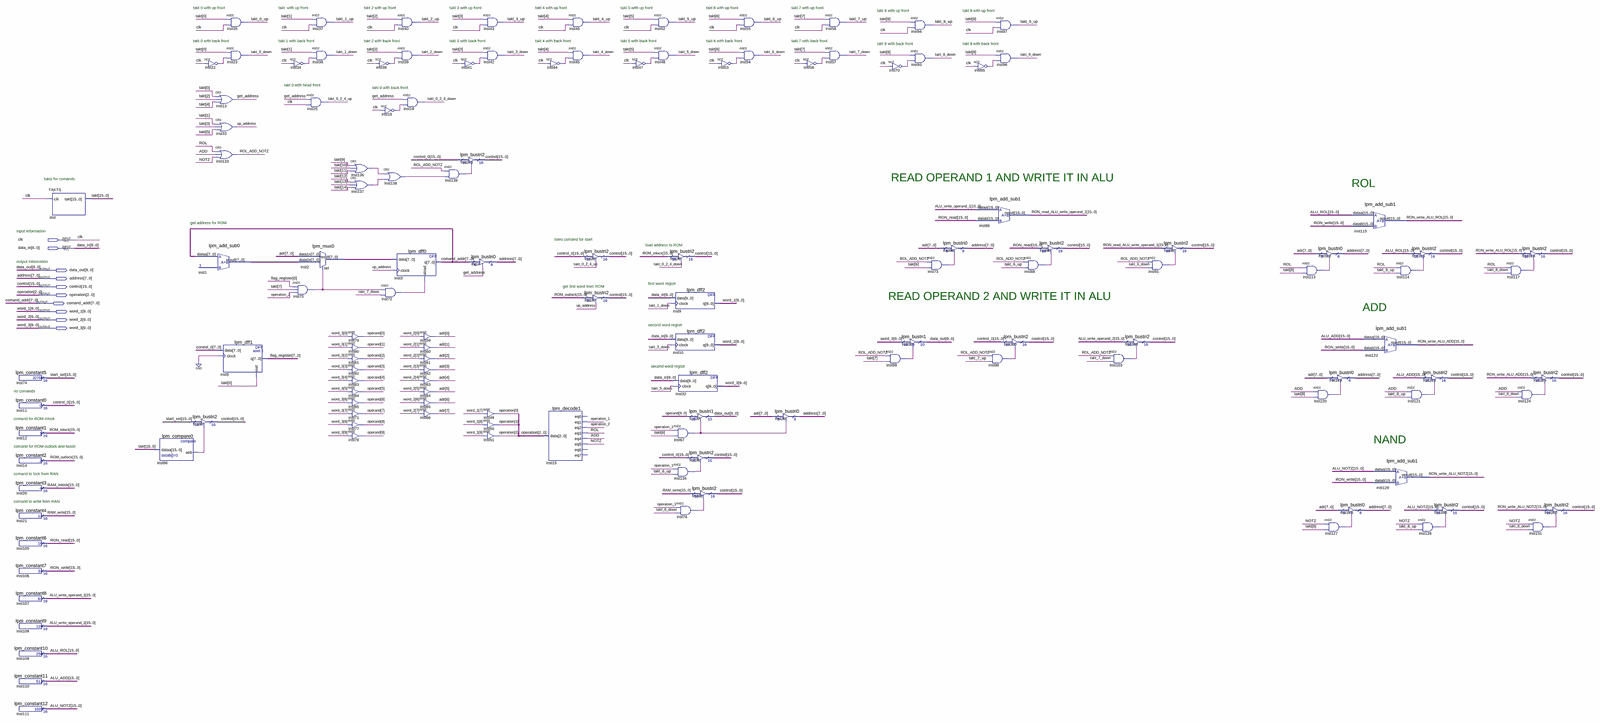
[diagram p0: schematic sheet, whole]
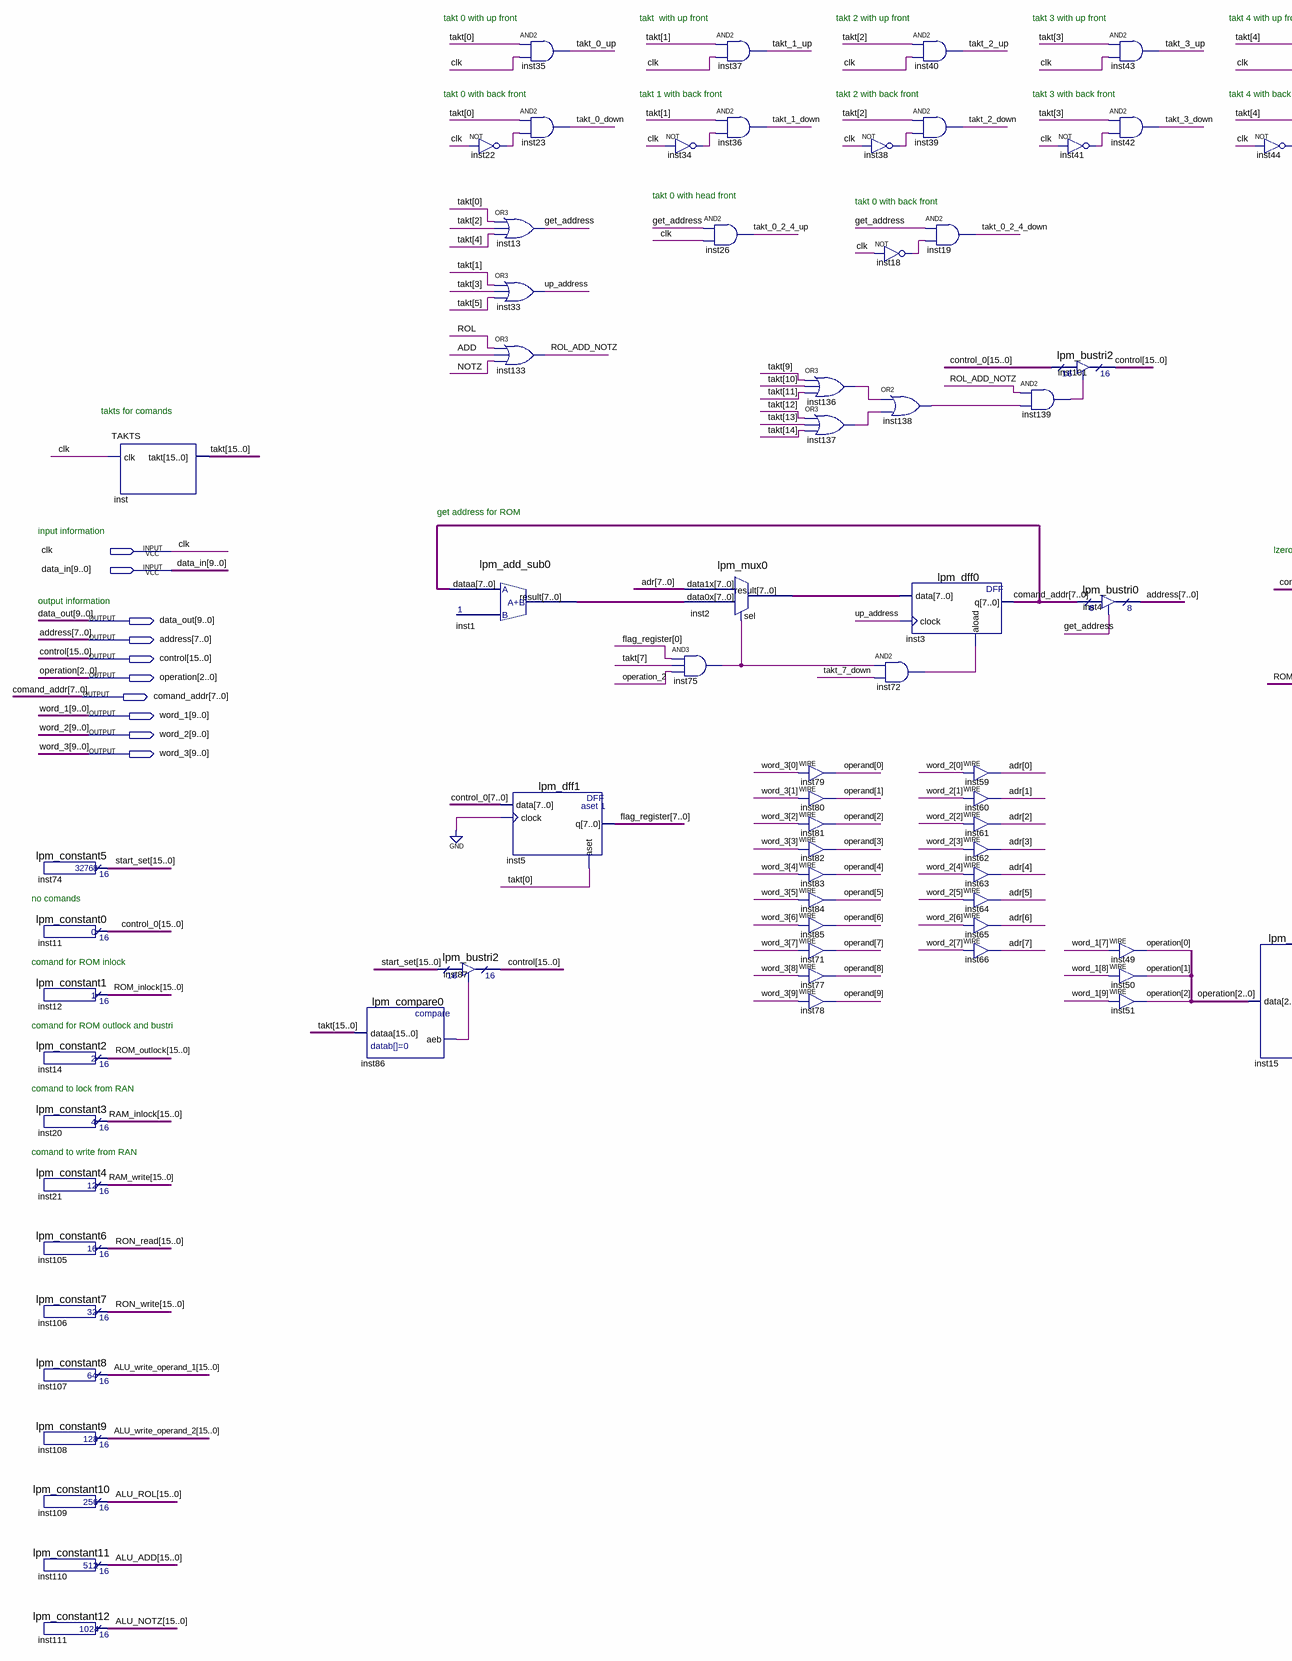
[diagram p1: schematic sheet, left part]
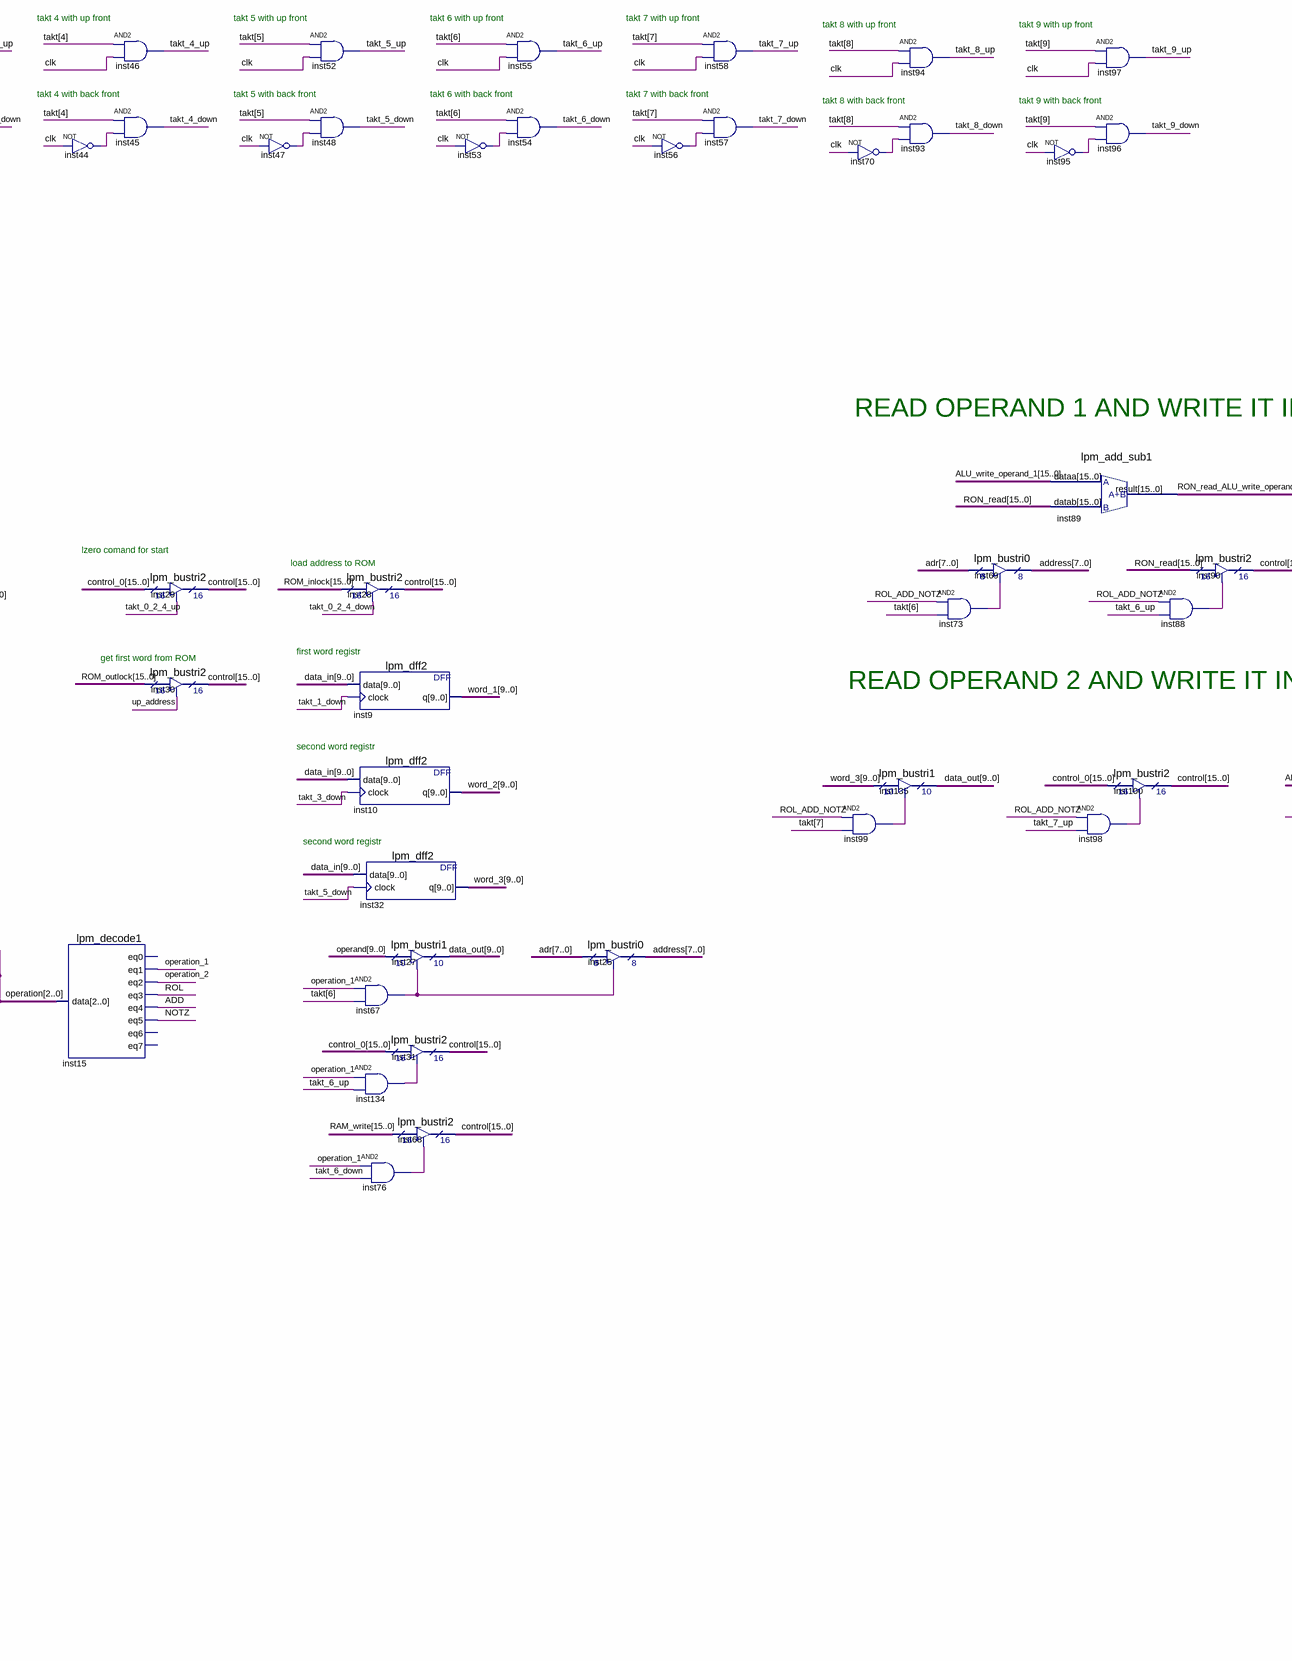
[diagram p2: schematic sheet, centre part]
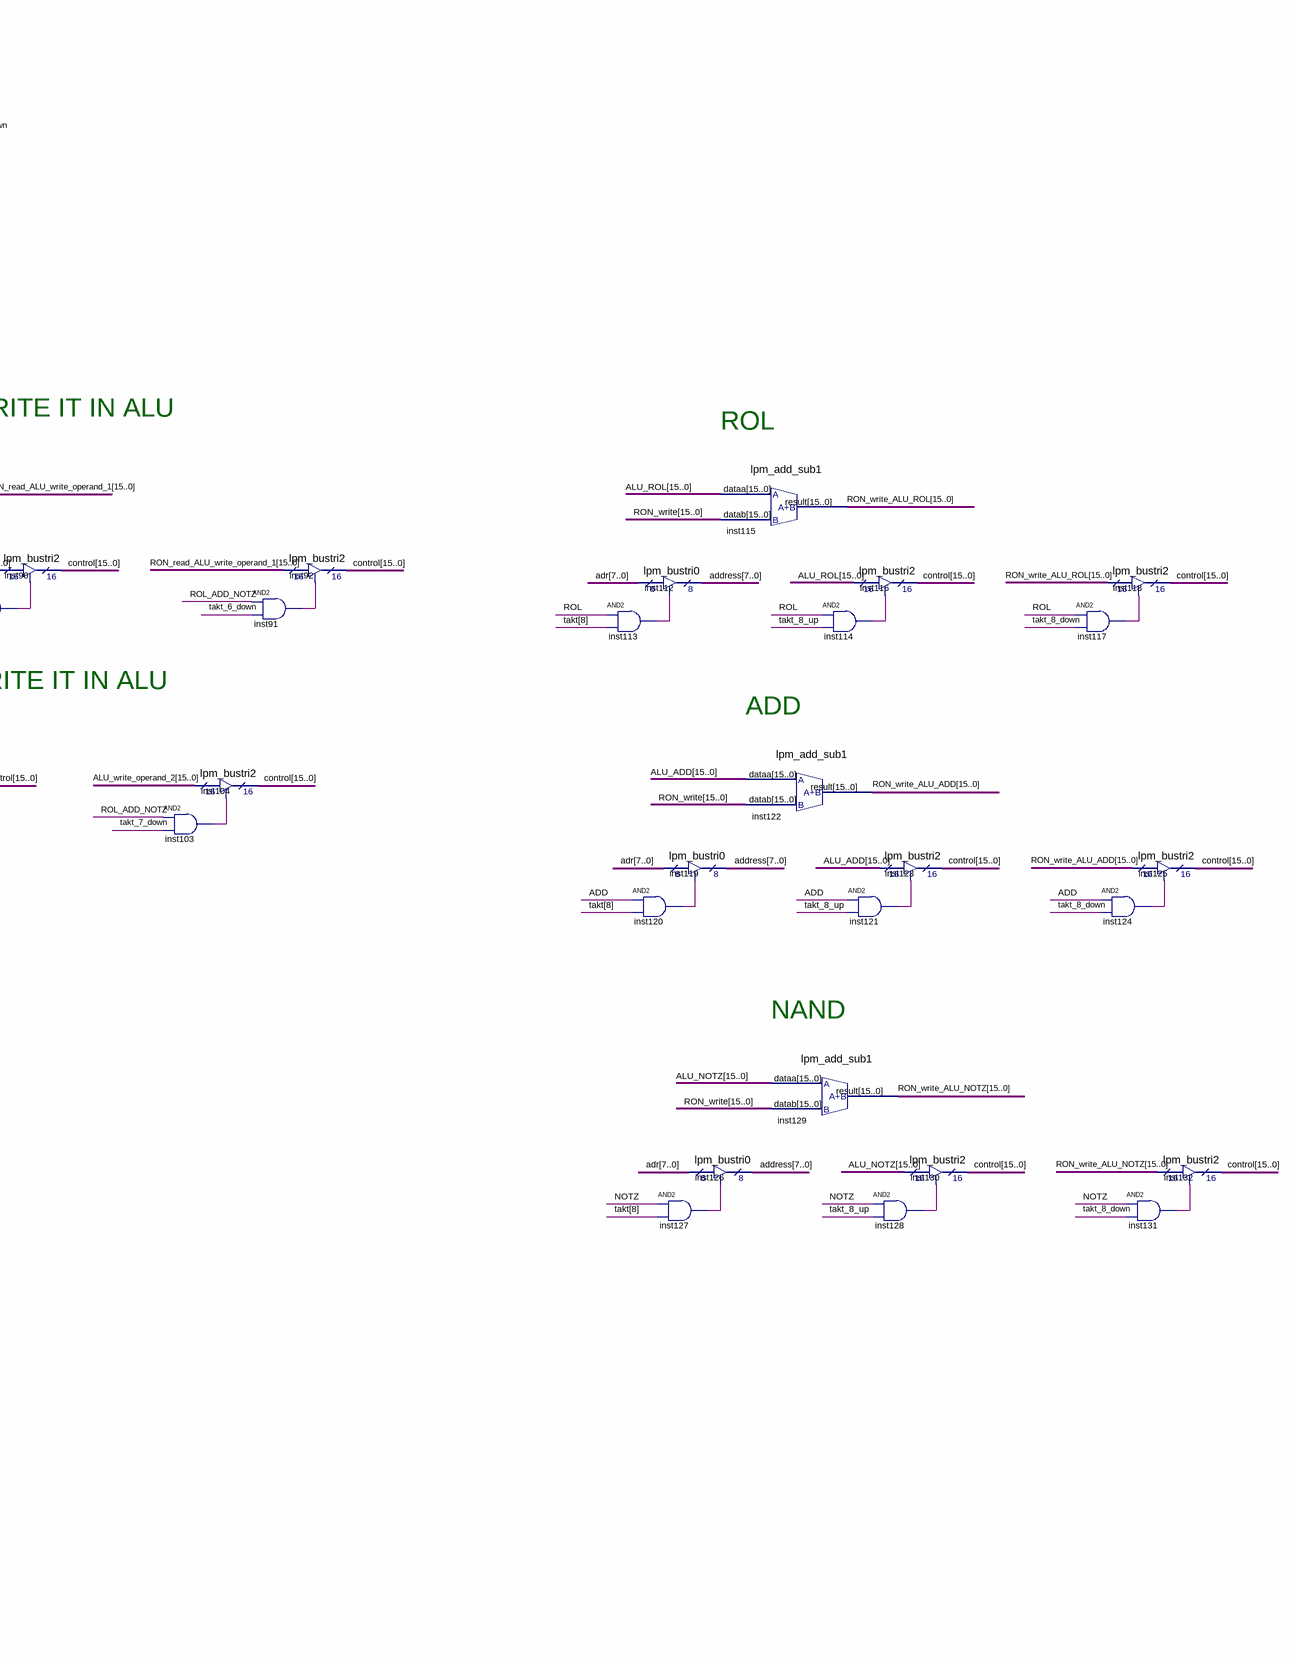
[diagram p3: schematic sheet, right part]
// Quartus schematic CONTROL.bdf as structural Verilog: 133 symbols, 10 pins
module CONTROL (
  input  clk,
  input  [9:0] data_in,
  output [9:0] data_out,
  output [7:0] address,
  output [15:0] control,
  output [2:0] operation,
  output [7:0] comand_addr,
  output [9:0] word_1,
  output [9:0] word_2,
  output [9:0] word_3
);

  wire ADD, get_address, inst18_out, inst22_out, inst34_out, inst38_out, inst41_out, inst44_out, inst47_out,
       inst53_out, inst56_out, inst67_out, inst70_out, inst72_out, inst73_out, inst75_out, inst76_out,
       inst86_aeb, inst88_out, inst91_out, inst95_out, inst98_out, inst99_out, inst103_out, inst113_out,
       inst114_out, inst117_out, inst120_out, inst121_out, inst124_out, inst127_out, inst128_out,
       inst131_out, inst134_out, inst136_out, inst137_out, inst138_out, inst139_out, NOTZ, operation_1,
       operation_2, ROL, ROL_ADD_NOTZ, takt_0_2_4_down, takt_0_2_4_up, takt_0_down, takt_0_up, takt_1_down,
       takt_1_up, takt_2_down, takt_2_up, takt_3_down, takt_3_up, takt_4_down, takt_4_up, takt_5_down,
       takt_5_up, takt_6_down, takt_6_up, takt_7_down, takt_7_up, takt_8_down, takt_8_up, takt_9_down,
       takt_9_up, up_address;
  wire [7:0] adr, flag_register, inst1_result, inst2_result;
  wire [9:0] operand;
  wire [15:0] ALU_ADD, ALU_NOTZ, ALU_ROL, ALU_write_operand_1, ALU_write_operand_2, control_0, RAM_inlock,
       RAM_write, ROM_inlock, ROM_outlock, RON_read, RON_read_ALU_write_operand_1, RON_write,
       RON_write_ALU_ADD, RON_write_ALU_NOTZ, RON_write_ALU_ROL, start_set, takt;

  lpm_constant5 inst74 (.result(start_set));
  lpm_constant0 inst11 (.result(control_0));
  lpm_constant1 inst12 (.result(ROM_inlock));
  lpm_constant2 inst14 (.result(ROM_outlock));
  lpm_constant3 inst20 (.result(RAM_inlock));
  lpm_constant4 inst21 (.result(RAM_write));
  lpm_constant6 inst105 (.result(RON_read));
  lpm_constant7 inst106 (.result(RON_write));
  lpm_constant8 inst107 (.result(ALU_write_operand_1));
  lpm_constant9 inst108 (.result(ALU_write_operand_2));
  lpm_constant10 inst109 (.result(ALU_ROL));
  lpm_constant11 inst110 (.result(ALU_ADD));
  lpm_constant12 inst111 (.result(ALU_NOTZ));
  TAKTS inst (.clk(clk), .takt(takt));
  lpm_compare0 inst86 (.dataa(takt), .aeb(inst86_aeb));
  lpm_bustri2 inst87 (.enabledt(inst86_aeb), .data(start_set), .tridata(control));
  not inst22 (inst22_out, clk);
  or inst13 (get_address, takt[0], takt[2], takt[4]);
  or inst33 (up_address, takt[1], takt[3], takt[5]);
  or inst133 (ROL_ADD_NOTZ, ROL, ADD, NOTZ);
  lpm_add_sub0 inst1 (.dataa(comand_addr), .result(inst1_result));
  and inst35 (takt_0_up, takt[0], clk);
  and inst23 (takt_0_down, takt[0], inst22_out);
  lpm_dff1 inst5 (.data(control_0[7:0]), .clock(1'b0), .aset(takt[0]), .q(flag_register));
  not inst34 (inst34_out, clk);
  lpm_mux0 inst2 (.data1x(adr), .data0x(inst1_result), .sel(inst75_out), .result(inst2_result));
  and inst75 (inst75_out, flag_register[0], takt[7], operation_2);
  and inst37 (takt_1_up, takt[1], clk);
  and inst36 (takt_1_down, takt[1], inst34_out);
  and inst26 (takt_0_2_4_up, get_address, clk);
  assign operand[0] = word_3[0];  // WIRE inst79
  assign operand[1] = word_3[1];  // WIRE inst80
  assign operand[2] = word_3[2];  // WIRE inst81
  assign operand[3] = word_3[3];  // WIRE inst82
  assign operand[4] = word_3[4];  // WIRE inst83
  assign operand[5] = word_3[5];  // WIRE inst84
  assign operand[6] = word_3[6];  // WIRE inst85
  assign operand[7] = word_3[7];  // WIRE inst71
  assign operand[8] = word_3[8];  // WIRE inst77
  assign operand[9] = word_3[9];  // WIRE inst78
  or inst136 (inst136_out, takt[9], takt[10], takt[11]);
  or inst137 (inst137_out, takt[12], takt[13], takt[14]);
  not inst38 (inst38_out, clk);
  not inst18 (inst18_out, clk);
  or inst138 (inst138_out, inst136_out, inst137_out);
  lpm_dff0 inst3 (.data(inst2_result), .clock(up_address), .aload(inst72_out), .q(comand_addr));
  and inst72 (inst72_out, inst75_out, takt_7_down);
  and inst40 (takt_2_up, takt[2], clk);
  and inst39 (takt_2_down, takt[2], inst38_out);
  and inst19 (takt_0_2_4_down, get_address, inst18_out);
  assign adr[0] = word_2[0];  // WIRE inst59
  assign adr[1] = word_2[1];  // WIRE inst60
  assign adr[2] = word_2[2];  // WIRE inst61
  assign adr[3] = word_2[3];  // WIRE inst62
  assign adr[4] = word_2[4];  // WIRE inst63
  assign adr[5] = word_2[5];  // WIRE inst64
  assign adr[6] = word_2[6];  // WIRE inst65
  assign adr[7] = word_2[7];  // WIRE inst66
  lpm_bustri2 inst101 (.enabledt(inst139_out), .data(control_0), .tridata(control));
  and inst139 (inst139_out, ROL_ADD_NOTZ, inst138_out);
  not inst41 (inst41_out, clk);
  lpm_bustri0 inst4 (.enabledt(get_address), .data(comand_addr), .tridata(address));
  and inst43 (takt_3_up, takt[3], clk);
  and inst42 (takt_3_down, takt[3], inst41_out);
  assign operation[0] = word_1[7];  // WIRE inst49
  assign operation[1] = word_1[8];  // WIRE inst50
  assign operation[2] = word_1[9];  // WIRE inst51
  not inst44 (inst44_out, clk);
  lpm_decode1 inst15 (
    .data(operation), .eq1(operation_1), .eq2(operation_2), .eq3(ROL), .eq4(ADD), .eq5(NOTZ));  // open: eq0, eq6, eq7
  and inst46 (takt_4_up, takt[4], clk);
  and inst45 (takt_4_down, takt[4], inst44_out);
  lpm_bustri2 inst29 (.enabledt(takt_0_2_4_up), .data(control_0), .tridata(control));
  lpm_bustri2 inst30 (.enabledt(up_address), .data(ROM_outlock), .tridata(control));
  not inst47 (inst47_out, clk);
  and inst52 (takt_5_up, takt[5], clk);
  and inst48 (takt_5_down, takt[5], inst47_out);
  lpm_bustri2 inst28 (.enabledt(takt_0_2_4_down), .data(ROM_inlock), .tridata(control));
  lpm_dff2 inst9 (.data(data_in), .clock(takt_1_down), .q(word_1));
  lpm_dff2 inst10 (.data(data_in), .clock(takt_3_down), .q(word_2));
  lpm_dff2 inst32 (.data(data_in), .clock(takt_5_down), .q(word_3));
  and inst67 (inst67_out, operation_1, takt[6]);
  and inst134 (inst134_out, operation_1, takt_6_up);
  and inst76 (inst76_out, operation_1, takt_6_down);
  lpm_bustri1 inst27 (.enabledt(inst67_out), .data(operand), .tridata(data_out));
  lpm_bustri2 inst31 (.enabledt(inst134_out), .data(control_0), .tridata(control));
  lpm_bustri2 inst68 (.enabledt(inst76_out), .data(RAM_write), .tridata(control));
  not inst53 (inst53_out, clk);
  and inst55 (takt_6_up, takt[6], clk);
  and inst54 (takt_6_down, takt[6], inst53_out);
  lpm_bustri0 inst25 (.enabledt(inst67_out), .data(adr), .tridata(address));
  not inst56 (inst56_out, clk);
  and inst58 (takt_7_up, takt[7], clk);
  and inst57 (takt_7_down, takt[7], inst56_out);
  not inst70 (inst70_out, clk);
  lpm_bustri1 inst135 (.enabledt(inst99_out), .data(word_3), .tridata(data_out));
  and inst99 (inst99_out, ROL_ADD_NOTZ, takt[7]);
  and inst94 (takt_8_up, takt[8], clk);
  and inst93 (takt_8_down, takt[8], inst70_out);
  lpm_bustri0 inst69 (.enabledt(inst73_out), .data(adr), .tridata(address));
  and inst73 (inst73_out, ROL_ADD_NOTZ, takt[6]);
  not inst95 (inst95_out, clk);
  lpm_add_sub1 inst89 (.dataa(ALU_write_operand_1), .datab(RON_read), .result(RON_read_ALU_write_operand_1));
  and inst98 (inst98_out, ROL_ADD_NOTZ, takt_7_up);
  and inst97 (takt_9_up, takt[9], clk);
  and inst96 (takt_9_down, takt[9], inst95_out);
  lpm_bustri2 inst100 (.enabledt(inst98_out), .data(control_0), .tridata(control));
  and inst88 (inst88_out, ROL_ADD_NOTZ, takt_6_up);
  lpm_bustri2 inst90 (.enabledt(inst88_out), .data(RON_read), .tridata(control));
  and inst103 (inst103_out, ROL_ADD_NOTZ, takt_7_down);
  lpm_bustri2 inst104 (.enabledt(inst103_out), .data(ALU_write_operand_2), .tridata(control));
  lpm_bustri2 inst92 (.enabledt(inst91_out), .data(RON_read_ALU_write_operand_1), .tridata(control));
  and inst91 (inst91_out, ROL_ADD_NOTZ, takt_6_down);
  lpm_bustri0 inst112 (.enabledt(inst113_out), .data(adr), .tridata(address));
  and inst113 (inst113_out, ROL, takt[8]);
  and inst120 (inst120_out, ADD, takt[8]);
  lpm_bustri0 inst119 (.enabledt(inst120_out), .data(adr), .tridata(address));
  lpm_bustri0 inst126 (.enabledt(inst127_out), .data(adr), .tridata(address));
  and inst127 (inst127_out, NOTZ, takt[8]);
  lpm_add_sub1 inst115 (.dataa(ALU_ROL), .datab(RON_write), .result(RON_write_ALU_ROL));
  lpm_add_sub1 inst122 (.dataa(ALU_ADD), .datab(RON_write), .result(RON_write_ALU_ADD));
  lpm_add_sub1 inst129 (.dataa(ALU_NOTZ), .datab(RON_write), .result(RON_write_ALU_NOTZ));
  and inst114 (inst114_out, ROL, takt_8_up);
  and inst121 (inst121_out, ADD, takt_8_up);
  lpm_bustri2 inst116 (.enabledt(inst114_out), .data(ALU_ROL), .tridata(control));
  lpm_bustri2 inst123 (.enabledt(inst121_out), .data(ALU_ADD), .tridata(control));
  and inst128 (inst128_out, NOTZ, takt_8_up);
  lpm_bustri2 inst130 (.enabledt(inst128_out), .data(ALU_NOTZ), .tridata(control));
  and inst117 (inst117_out, ROL, takt_8_down);
  and inst124 (inst124_out, ADD, takt_8_down);
  lpm_bustri2 inst118 (.enabledt(inst117_out), .data(RON_write_ALU_ROL), .tridata(control));
  lpm_bustri2 inst125 (.enabledt(inst124_out), .data(RON_write_ALU_ADD), .tridata(control));
  and inst131 (inst131_out, NOTZ, takt_8_down);
  lpm_bustri2 inst132 (.enabledt(inst131_out), .data(RON_write_ALU_NOTZ), .tridata(control));

  // Notes on the sheet:
  //   takt 0 with up front
  //   takt  with up front
  //   takt 2 with up front
  //   takt 3 with up front
  //   takt 4 with up front
  //   takt 5 with up front
  //   takt 6 with up front
  //   takt 7 with up front
  //   takt 8 with up front
  //   takt 9 with up front
  //   takt 0 with back front
  //   takt 1 with back front
  //   takt 2 with back front
  //   takt 3 with back front
  //   takt 4 with back front
  //   takt 5 with back front
  //   takt 6 with back front
  //   takt 7 with back front
  //   takt 8 with back front
  //   takt 9 with back front
  //   takt 0 with head front
  //   takt 0 with back front
  //   READ OPERAND 1 AND WRITE IT IN ALU
  //   takts for comands
  //   ROL
  //   get address for ROM
  //   input information
  //   lzero comand for start
  //   load address to ROM
  //   output information
  //   first word registr
  //   get first word from ROM
  //   READ OPERAND 2 AND WRITE IT IN ALU
  //   ADD
  //   second word registr
  //   second word registr
  //   no comands
  //   comand for ROM inlock
  //   NAND
  //   comand for ROM outlock and bustri
  //   comand to lock from RAN
  //   comand to write from RAN
endmodule
